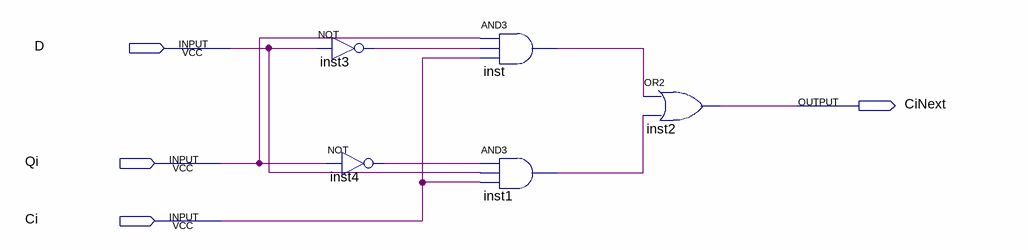
[diagram p0: schematic sheet]
// Quartus schematic CiNext.bdf as structural Verilog: 5 symbols, 4 pins
module CiNext (
  input  D,
  input  Qi,
  input  Ci,
  output CiNext
);

  wire inst1_out, inst3_out, inst4_out, inst_out;

  not inst3 (inst3_out, D);
  not inst4 (inst4_out, Qi);
  and inst (inst_out, Qi, inst3_out, Ci);
  and inst1 (inst1_out, inst4_out, D, Ci);
  or inst2 (CiNext, inst_out, inst1_out);
endmodule
